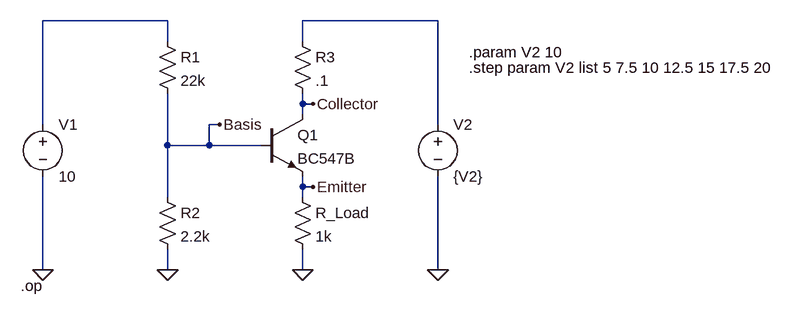
[diagram p0: schematic CurrentSources.asc]
CurrentSources.asc, the LTspice schematic file:
Version 4
SHEET 1 1040 680
WIRE 16 -16 -176 -16
WIRE 432 -16 224 -16
WIRE 16 16 16 -16
WIRE 224 16 224 -16
WIRE 224 112 224 96
WIRE 240 112 224 112
WIRE 224 128 224 112
WIRE -176 144 -176 -16
WIRE 96 144 80 144
WIRE 432 144 432 -16
WIRE 16 176 16 96
WIRE 80 176 80 144
WIRE 80 176 16 176
WIRE 160 176 80 176
WIRE 224 240 224 224
WIRE 240 240 224 240
WIRE 16 256 16 176
WIRE 224 256 224 240
WIRE -176 368 -176 224
WIRE 16 368 16 336
WIRE 224 368 224 336
WIRE 432 368 432 224
FLAG -176 368 0
FLAG 16 368 0
FLAG 224 368 0
FLAG 432 368 0
FLAG 96 144 Basis
FLAG 240 240 Emitter
FLAG 240 112 Collector
SYMBOL npn 160 128 R0
SYMATTR InstName Q1
SYMATTR Value BC547B
SYMBOL res 0 0 R0
SYMATTR InstName R1
SYMATTR Value 22k
SYMBOL res 0 240 R0
SYMATTR InstName R2
SYMATTR Value 2.2k
SYMBOL res 208 240 R0
SYMATTR InstName R_Load
SYMATTR Value 1k
SYMBOL voltage -176 128 R0
WINDOW 123 0 0 Left 2
WINDOW 39 0 0 Left 2
SYMATTR InstName V1
SYMATTR Value 10
SYMBOL voltage 432 128 R0
WINDOW 123 0 0 Left 2
WINDOW 39 0 0 Left 2
SYMATTR InstName V2
SYMATTR Value {V2}
SYMBOL res 208 0 R0
SYMATTR InstName R3
SYMATTR Value .1
TEXT -210 392 Left 2 !.op
TEXT 480 56 Left 2 !.step param V2 list 5 7.5 10 12.5 15 17.5 20
TEXT 480 32 Left 2 !.param V2 10

The netlist it stands for:
* CurrentSources.asc
Q1 Collector Basis Emitter 0 BC547B
R1 N001 Basis 22k
R2 Basis 0 2.2k
R_Load Emitter 0 1k
V1 N001 0 10
V2 N002 0 {V2}
R3 N002 Collector .1
.model NPN NPN
.model PNP PNP
.lib standard.bjt
.op
.step param V2 list 5 7.5 10 12.5 15 17.5 20
.param V2 10
.backanno
.end